# Altium schematic sheet STAC_Test_Board_v1_USB.SchDoc: STAC USB to UART/JTAG
size B; DrawnBy: Rahul Kumar; Revision: X1; SheetNumber: 3; SheetTotal: 5
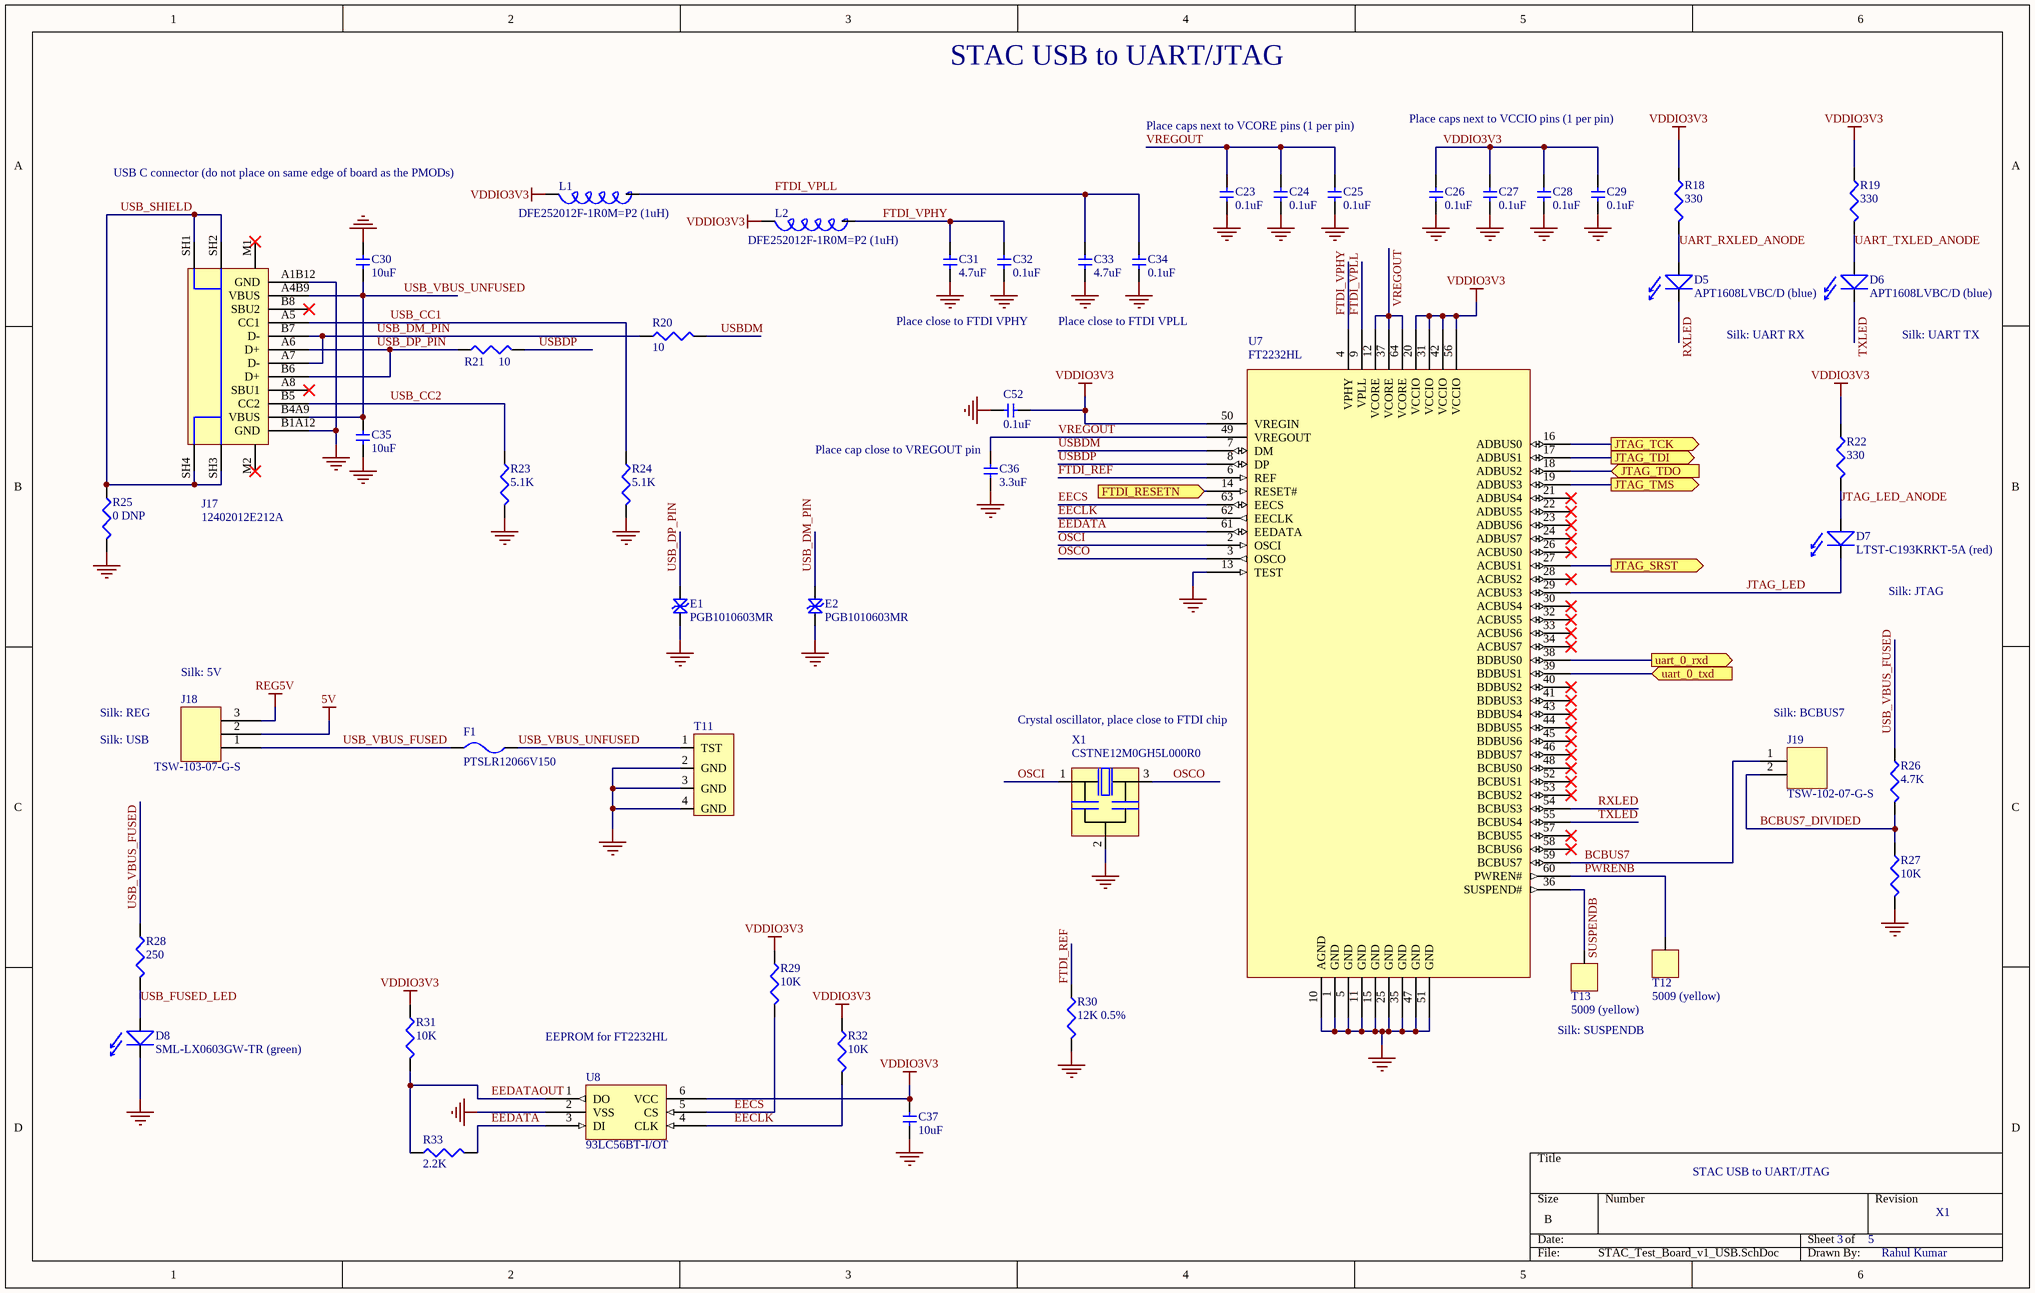
[diagram p0: STAC_Test_Board_v1_USB.SchDoc]

## Parts
C23  0.1uF  [0603]
C24  0.1uF  [0603]
C25  0.1uF  [0603]
C26  0.1uF  [0603]
C27  0.1uF  [0603]
C28  0.1uF  [0603]
C29  0.1uF  [0603]
C30  10uF  [0603]
C31  4.7uF  [0603]
C32  0.1uF  [0603]
C33  4.7uF  [0603]
C34  0.1uF  [0603]
C35  10uF  [0603]
C36  3.3uF  [0603]
C37  10uF  [0603]
C52  0.1uF  [0603]
D5  APT1608LVBC/D (blue)  [LED-0603]
D6  APT1608LVBC/D (blue)  [LED-0603]
D7  LTST-C193KRKT-5A (red)  [LED-0603]
D8  SML-LX0603GW-TR (green)  [LED-0603]
E1  PGB1010603MR  [0603]
E2  PGB1010603MR  [0603]
F1  PTSLR12066V150  [1206]
J17  12402012E212A  [CON-012-0.5-8.90X7.4/USB-C]
J18  TSW-103-07-G-S  [CON-003-100-300X100/1X3-POST]
J19  TSW-102-07-G-S  [CON-002-100-200X100/1X2-POST]
L1  DFE252012F-1R0M=P2 (1uH)  [1008]
L2  DFE252012F-1R0M=P2 (1uH)  [1008]
R18  330  [0603]
R19  330  [0603]
R20  10  [0603]
R21  10  [0603]
R22  330  [0603]
R23  5.1K  [0603]
R24  5.1K  [0603]
R25  0 DNP  [0603]
R26  4.7K  [0603]
R27  10K  [0603]
R28  250  [0603]
R29  10K  [0603]
R30  12K 0.5%  [0603]
R31  10K  [0603]
R32  10K  [0603]
R33  2.2K  [0603]
T11  TEST_PT_4  [TP-04-40/ROUND-THT]  (value not drawn)
T12  5009 (yellow)  [TP-63/ROUND-THT]
T13  5009 (yellow)  [TP-63/ROUND-THT]
U7  FT2232HL  [QFP-64-.5-12.0X12.0]
U8  93LC56BT-I/OT  [SOT-23-6]
X1  CSTNE12M0GH5L000R0  [XTAL-03-1.2-3.2X1.3/MURATA]

## Ports
FTDI_RESETN (in, see STAC_Test_Board_v1[3D], STAC_Test_Board_v1_SwitchesButtons[6D]), JTAG_SRST (out, see STAC_Test_Board_v1[3D], STAC_Test_Board_v1_SwitchesButtons[2B]), JTAG_TCK (out, see STAC_Test_Board_v1[3C]), JTAG_TDI (out, see STAC_Test_Board_v1[3C]), JTAG_TDO (in, see STAC_Test_Board_v1[3D]), JTAG_TMS (out, see STAC_Test_Board_v1[3D]), uart_0_rxd (out, see STAC_Test_Board_v1[3C]), uart_0_txd (in, see STAC_Test_Board_v1[3C])

## Nets
5V: J18.2
GND: C23.2 C24.2 C25.2 C26.2 C27.2 C28.2 C29.2 C30.1 C31.2 C32.2 C33.2 C34.2 C35.2 C36.2 C37.2 C52.1 D8.1 E1.2 E2.2 J17.A1B12(GND) J17.B1A12(GND) R23.2 R24.2 R25.2 R27.2 R30.2 T11.2(GND) T11.3(GND) T11.4(GND) U7.1(GND) U7.5(GND) U7.10(AGND) U7.11(GND) U7.13(TEST) U7.15(GND) U7.25(GND) U7.35(GND) U7.47(GND) U7.51(GND) U8.2(VSS) X1.2(GND)
REG5V: J18.3
VDDIO3V3: C26.1 C27.1 C28.1 C29.1 C37.1 C52.2 L1.2 L2.2 R18.1 R19.1 R22.1 R29.1 R31.1 R32.1 U7.20(VCCIO) U7.31(VCCIO) U7.42(VCCIO) U7.50(VREGIN) U7.56(VCCIO) U8.6(VCC)
BCBUS7: J19.1 U7.59(BCBUS7)
BCBUS7_DIVIDED: J19.2 R26.2 R27.1
EECLK: R32.2 U7.62(EECLK) U8.4(CLK)
EECS: R29.2 U7.63(EECS) U8.5(CS)
EEDATA: R33.2 U7.61(EEDATA) U8.3(DI)
EEDATAOUT: R31.2 R33.1 U8.1(DO)
FTDI_REF: R30.1 U7.6(REF)
FTDI_RESETN: U7.14(RESET#) ; port FTDI_RESETN
FTDI_VPHY: C31.1 C32.1 L2.1 U7.4(VPHY)
FTDI_VPLL: C33.1 C34.1 L1.1 U7.9(VPLL)
JTAG_LED: D7.1 U7.29(ACBUS3)
JTAG_LED_ANODE: D7.2 R22.2
JTAG_SRST: U7.27(ACBUS1) ; port JTAG_SRST
JTAG_TCK: U7.16(ADBUS0) ; port JTAG_TCK
JTAG_TDI: U7.17(ADBUS1) ; port JTAG_TDI
JTAG_TDO: U7.18(ADBUS2) ; port JTAG_TDO
JTAG_TMS: U7.19(ADBUS3) ; port JTAG_TMS
OSCI: U7.2(OSCI) X1.1(INPUT)
OSCO: U7.3(OSCO) X1.3(OUTPUT)
PWRENB: T12.1 U7.60(PWREN#)
RXLED: D5.1 U7.54(BCBUS3)
SUSPENDB: T13.1 U7.36(SUSPEND#)
TXLED: D6.1 U7.55(BCBUS4)
uart_0_rxd: U7.38(BDBUS0) ; port uart_0_rxd
uart_0_txd: U7.39(BDBUS1) ; port uart_0_txd
UART_RXLED_ANODE: D5.2 R18.2
UART_TXLED_ANODE: D6.2 R19.2
USB_CC1: J17.A5(CC1) R24.1
USB_CC2: J17.B5(CC2) R23.1
USB_DM_PIN: E2.1 J17.A7(D-) J17.B7(D-) R20.1
USB_DP_PIN: E1.1 J17.A6(D+) J17.B6(D+) R21.1
USB_FUSED_LED: D8.2 R28.2
USB_SHIELD: J17.SH1 J17.SH2 J17.SH3 J17.SH4 R25.1
USB_VBUS_FUSED: F1.2 J18.1 R26.1 R28.1
USB_VBUS_UNFUSED: C30.2 C35.1 F1.1 J17.A4B9(VBUS) J17.B4A9(VBUS) T11.1(TST)
USBDM: R20.2 U7.7(DM)
USBDP: R21.2 U7.8(DP)
VREGOUT: C23.1 C24.1 C25.1 C36.1 U7.12(VCORE) U7.37(VCORE) U7.49(VREGOUT) U7.64(VCORE)

Not connected (* = marked no-connect by the designer): J17 A8(SBU1)* B8(SBU2)* M1* M2*; U7 21(ADBUS4)* 22(ADBUS5)* 23(ADBUS6)* 24(ADBUS7)* 26(ACBUS0)* 28(ACBUS2)* 30(ACBUS4)* 32(ACBUS5)* 33(ACBUS6)* 34(ACBUS7)* 40(BDBUS2)* 41(BDBUS3)* 43(BDBUS4)* 44(BDBUS5)* 45(BDBUS6)* 46(BDBUS7)* 48(BCBUS0)* 52(BCBUS1)* 53(BCBUS2)* 57(BCBUS5)* 58(BCBUS6)*

## Notes on the sheet
- Place caps next to VCORE pins (1 per pin)
- Place caps next to VCCIO pins (1 per pin)
- USB C connector (do not place on same edge of board as the PMODs)
- Place close to FTDI VPHY
- Place close to FTDI VPLL
- Silk: UART RX
- Silk: UART TX
- (near C36) Place cap close to VREGOUT pin
- Silk: JTAG
- (near J18) Silk: 5V
- Silk: REG
- Silk: USB
- (near U7) Crystal oscillator, place close to FTDI chip
- Silk: BCBUS7
- EEPROM for FT2232HL
- Silk: SUSPENDB

## Library data of the parts
C23-C37 C52 = DISCRETE_C: Capacitor generic
D5-D8 = DISCRETE_LED: LED generic
E1 E2 = DISCRETE_TVS: TVS ESD protection clamp generic
F1 = DISCRETE_F: Fuse generic
J17 = CON_012pin_USB_C_RECP: Con 12 pin USB C receptacle + 4 shields, and 2 alignment posts
J18 = CON_003pin_1x3: Con 3 pins
J19 = CON_002pin_1x2: Con 2 pins
L1 L2 = DISCRETE_L: Inductor generic
R18-R22 R25-R33 = DISCRETE_R: Resistor generic
R23 R24 = DISCRETE_R: 5.1kohm resistor
T11 = TEST_PT_4: Test point 4 pads for probing
T12 T13 = TEST_PT: Test point 1 pin
U7 = IC_FT2232HL: USB Hi-Speed to Dual Channel Serial UART/FIFO/JTAG/SPI/I2C IC 64-pin LQFP package
U8 = IC_93LC56BT-I/OT: EEPROM Non-Volatile Memory 2kbit 128x16 2MHz 2.5V-5.5V SOT-23-6
X1 = XTALOSC_CAP: crystal oscillator with internal loading capacitors, 3 pins (input, GND, output)